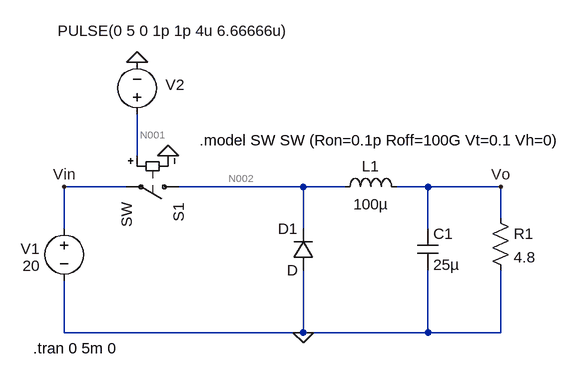
[diagram p0: schematic Draft1.asc]
Draft1.asc, the LTspice schematic file:
Version 4
SHEET 1 952 680
WIRE 144 16 144 -48
WIRE 128 64 32 64
WIRE 400 64 208 64
WIRE 464 64 400 64
WIRE 592 64 544 64
WIRE 704 64 592 64
WIRE 704 112 704 64
WIRE 32 128 32 64
WIRE 400 128 400 64
WIRE 592 128 592 64
WIRE 32 288 32 208
WIRE 400 288 400 192
WIRE 400 288 32 288
WIRE 592 288 592 192
WIRE 592 288 400 288
WIRE 704 288 704 192
WIRE 704 288 592 288
FLAG 400 288 0
FLAG 704 64 Vo
FLAG 32 64 Vin
FLAG 144 -128 0
FLAG 192 16 0
SYMBOL voltage 32 112 R0
WINDOW 123 0 0 Left 0
WINDOW 39 0 0 Left 0
WINDOW 0 -67 47 Left 2
WINDOW 3 -64 73 Left 2
SYMATTR InstName V1
SYMATTR Value 20
SYMBOL ind 448 80 R270
WINDOW 0 32 56 VTop 2
WINDOW 3 5 56 VBottom 2
SYMATTR InstName L1
SYMATTR Value 100µ
SYMBOL diode 416 192 R180
WINDOW 0 24 64 Left 2
WINDOW 3 24 0 Left 2
SYMATTR InstName D1
SYMBOL cap 576 128 R0
SYMATTR InstName C1
SYMATTR Value 25µ
SYMBOL res 688 96 R0
SYMATTR InstName R1
SYMATTR Value 4.8
SYMBOL sw 224 64 R90
SYMATTR InstName S1
SYMBOL voltage 144 -32 R180
WINDOW 3 122 144 Right 2
WINDOW 123 0 0 Left 0
WINDOW 39 0 0 Left 0
WINDOW 0 -73 61 Left 2
SYMATTR Value PULSE(0 5 0 1p 1p 4u 6.66666u)
SYMATTR InstName V2
TEXT -16 312 Left 2 !.tran 0 5m 0
TEXT 240 -8 Left 2 !.model SW SW (Ron=0.1p Roff=100G Vt=0.1 Vh=0)

The netlist it stands for:
* Draft1.asc
V1 Vin 0 20
L1 N002 Vo 100µ
D1 0 N002 D
C1 Vo 0 25µ
R1 Vo 0 4.8
S1 N002 Vin N001 0 SW
V2 N001 0 PULSE(0 5 0 1p 1p 4u 6.66666u)
.model D D
.lib standard.dio
.tran 0 5m 0
.model SW SW (Ron=0.1p Roff=100G Vt=0.1 Vh=0)
.backanno
.end

* Results of the author's LTspice run, read from the files saved beside the schematic
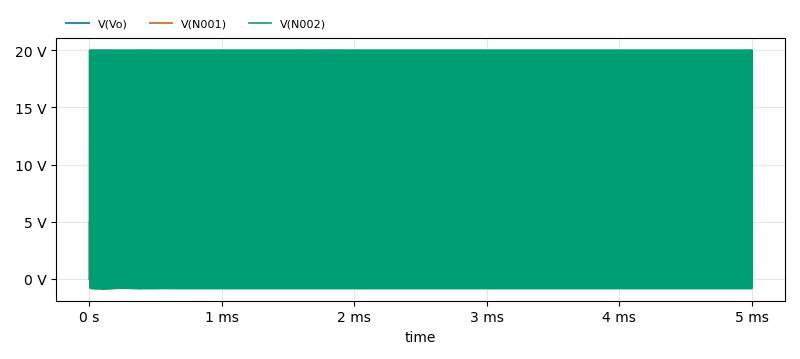
[diagram p1: Transient Analysis of Draft1.asc, plotted from the saved traces]
* Transient Analysis, 1 run:
*   V(Vo): min 0 V, max 17.61 V, average 11.61 V, rms 11.69 V, last 11.66 V
*   V(N001): min 0 V, max 5 V, average 3 V, rms 3.873 V, last 5 V
*   V(N002): min -882.6 mV, max 20 V, average 11.66 V, rms 15.5 V, last 20 V